# EAGLE schematic LabPower-FB_V2 (EAGLE 7.7.0)
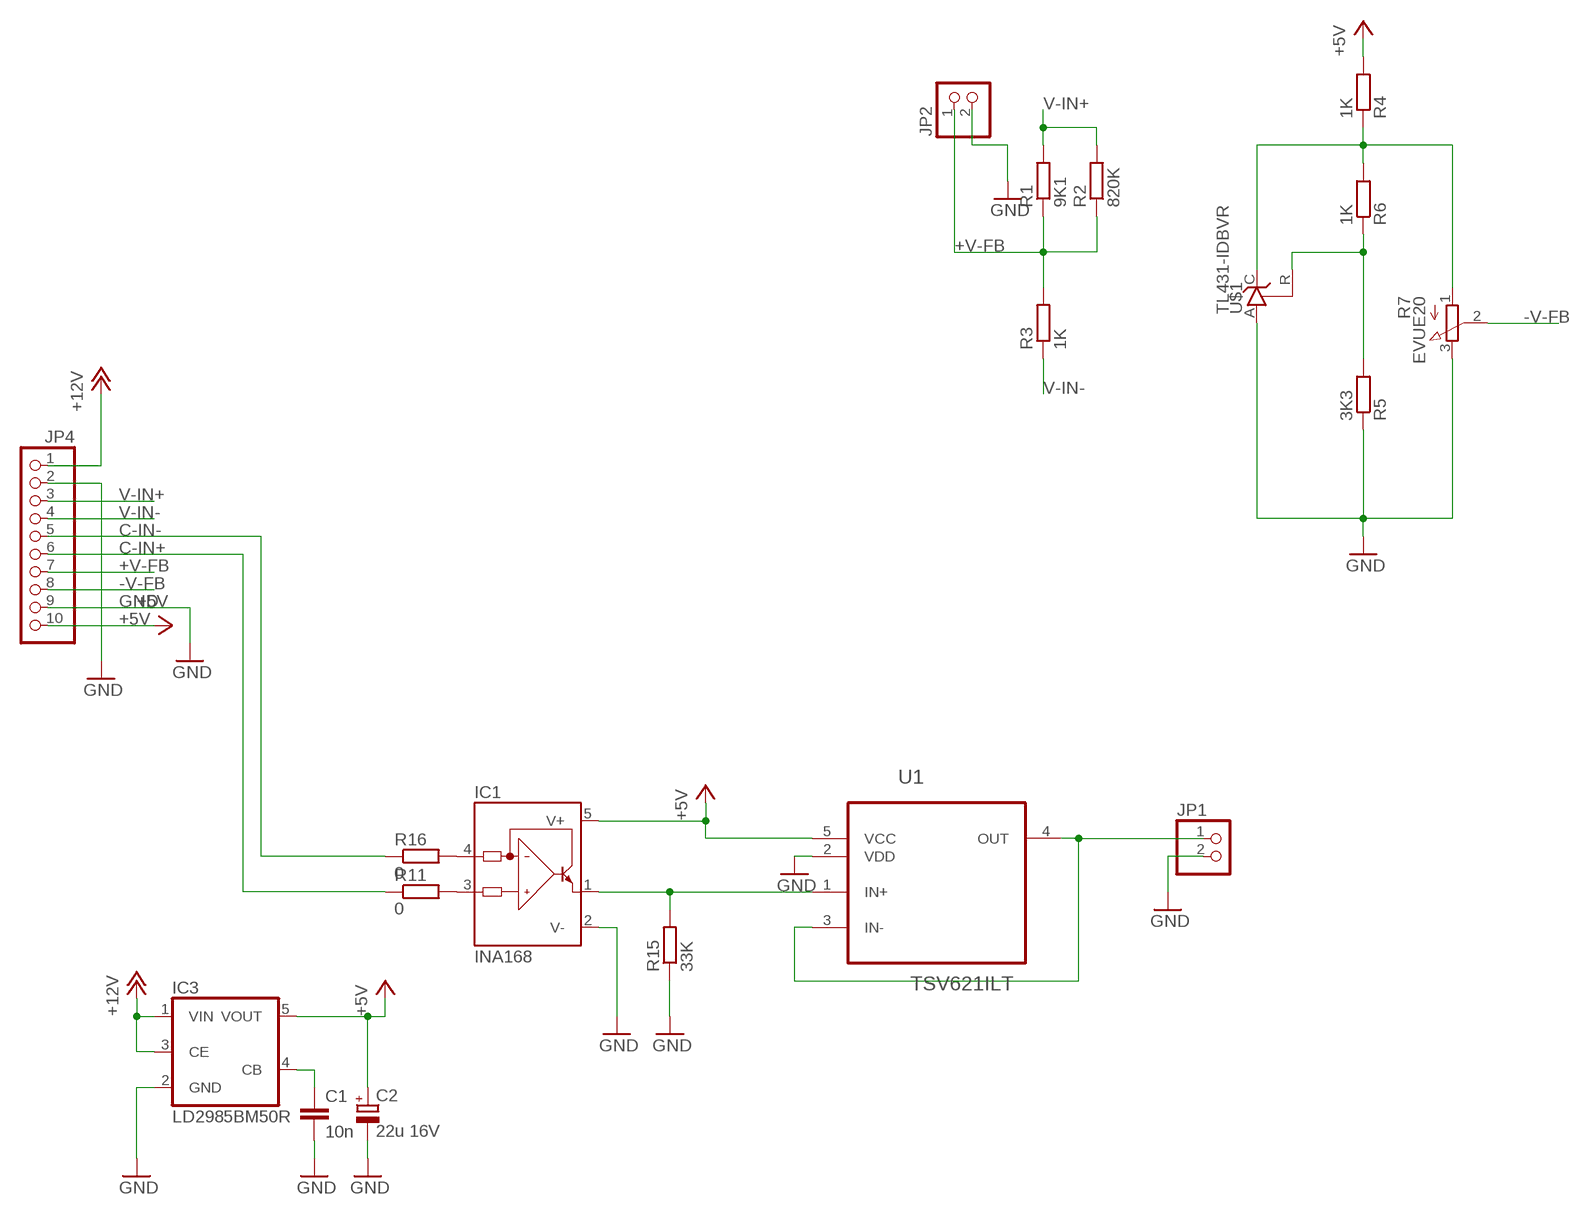
[diagram p0: schematic, sheet 1]

## Parts
C1  10n  C-EUC0805  [C0805]
C2  22u 16V  CPOL-EUB/3528-21W  [B/3528-21W]
IC1  INA168  [SOT23-5]
IC3  LD2985BM50R  TS5205  [SOT25]
JP1  PINHD-1X2/90  [1X02/90]
JP2  PINHD-1X2/90  [1X02/90]
JP4  PINHD-1X10  [1X10]
R1  9K1  R-EU_R0805  [R0805]
R2  820K  R-EU_R0805  [R0805]
R3  1K  R-EU_R0805  [R0805]
R4  1K  R-EU_R0805  [R0805]
R5  3K3  R-EU_R0805  [R0805]
R6  1K  R-EU_R0805  [R0805]
R7  EVUE20  [EVUE]
R11  0  R-EU_R0805  [R0805]
R15  33K  R-EU_R0805  [R0805]
R16  0  R-EU_R0805  [R0805]
U1  TSV621ILT  [SOT95P280X145-5N]
U$1  TL431-IDBVR  [SOT23-5]

## Nets
+5V: C2.+ IC1.5(V+) IC3.5(VOUT) JP4.10 R4.2 U1.5(VCC)
+12V: IC3.1(VIN) IC3.3(CE) JP4.1
+V-FB: JP2.1 JP4.7 R1.1 R2.1 R3.2
-V-FB: JP4.8 R7.2(S)
C-IN+: JP4.6 R11.1
C-IN-: JP4.5 R16.1
GND: C1.2 C2.- IC1.2(V-) IC3.2(GND) JP1.2 JP2.2 JP4.2 JP4.9 R5.1 R7.3(E) R15.1 U1.2(VDD) U$1.A
N$1: R4.1 R6.2 R7.1(A) U$1.C
N$2: R5.2 R6.1 U$1.R
N$3: IC1.4(IN-) R16.2
N$4: IC1.3(IN+) R11.2
N$5: C1.1 IC3.4(CB)
N$7: JP1.1 U1.3(IN-) U1.4(OUT)
N$8: IC1.1(OUT) R15.2 U1.1(IN+)
V-IN+: JP4.3 R1.2 R2.2
V-IN-: JP4.4 R3.1

## Library data of the parts
C1 = rcl:C-EU: CAPACITOR, European symbol
C2 = rcl:CPOL-EU: POLARIZED CAPACITOR, European symbol
IC1 = burr-brown:INA168: High-Side Measurement Current Shunt Monitor; MF: TEXAS INSTRUMENTS; MPN: INA168NA/250; OC_FARNELL: 4375737; OC_NEWARK: 35C1744
IC3 = v-reg:TS5205: 150mA Low Noise LDO Voltage Regulator with Enable TSC [Taiwan Semiconductor Company, Ltd] Source: http://www.taiwansemi.com .. 5205_0409c.pdf
JP1 JP2 = pinhead:PINHD-1X2: PIN HEADER
JP4 = pinhead:PINHD-1X10: PIN HEADER
R1-R6 R11 R15 R16 = rcl:R-EU_: RESISTOR, European symbol
R7 = pot:EVU: 9 mm Square Rotary Potentiometers Source: Panasonic
U1 = ST Microelctronics_By_element14_Batch_1:TSV621ILT: operational amplifiers; MPN: TSV621ILT; OC_FARNELL: 1737213; OC_NEWARK: 26R7211; PACKAGE: SOT-23-5; SUPPLIER: STMICROELECTRONICS
U$1 = TL431:TL431-IDBVR

## Net classes
0 default: clearance 0.205 mm